# EAGLE schematic team18 (EAGLE 8.6.3)
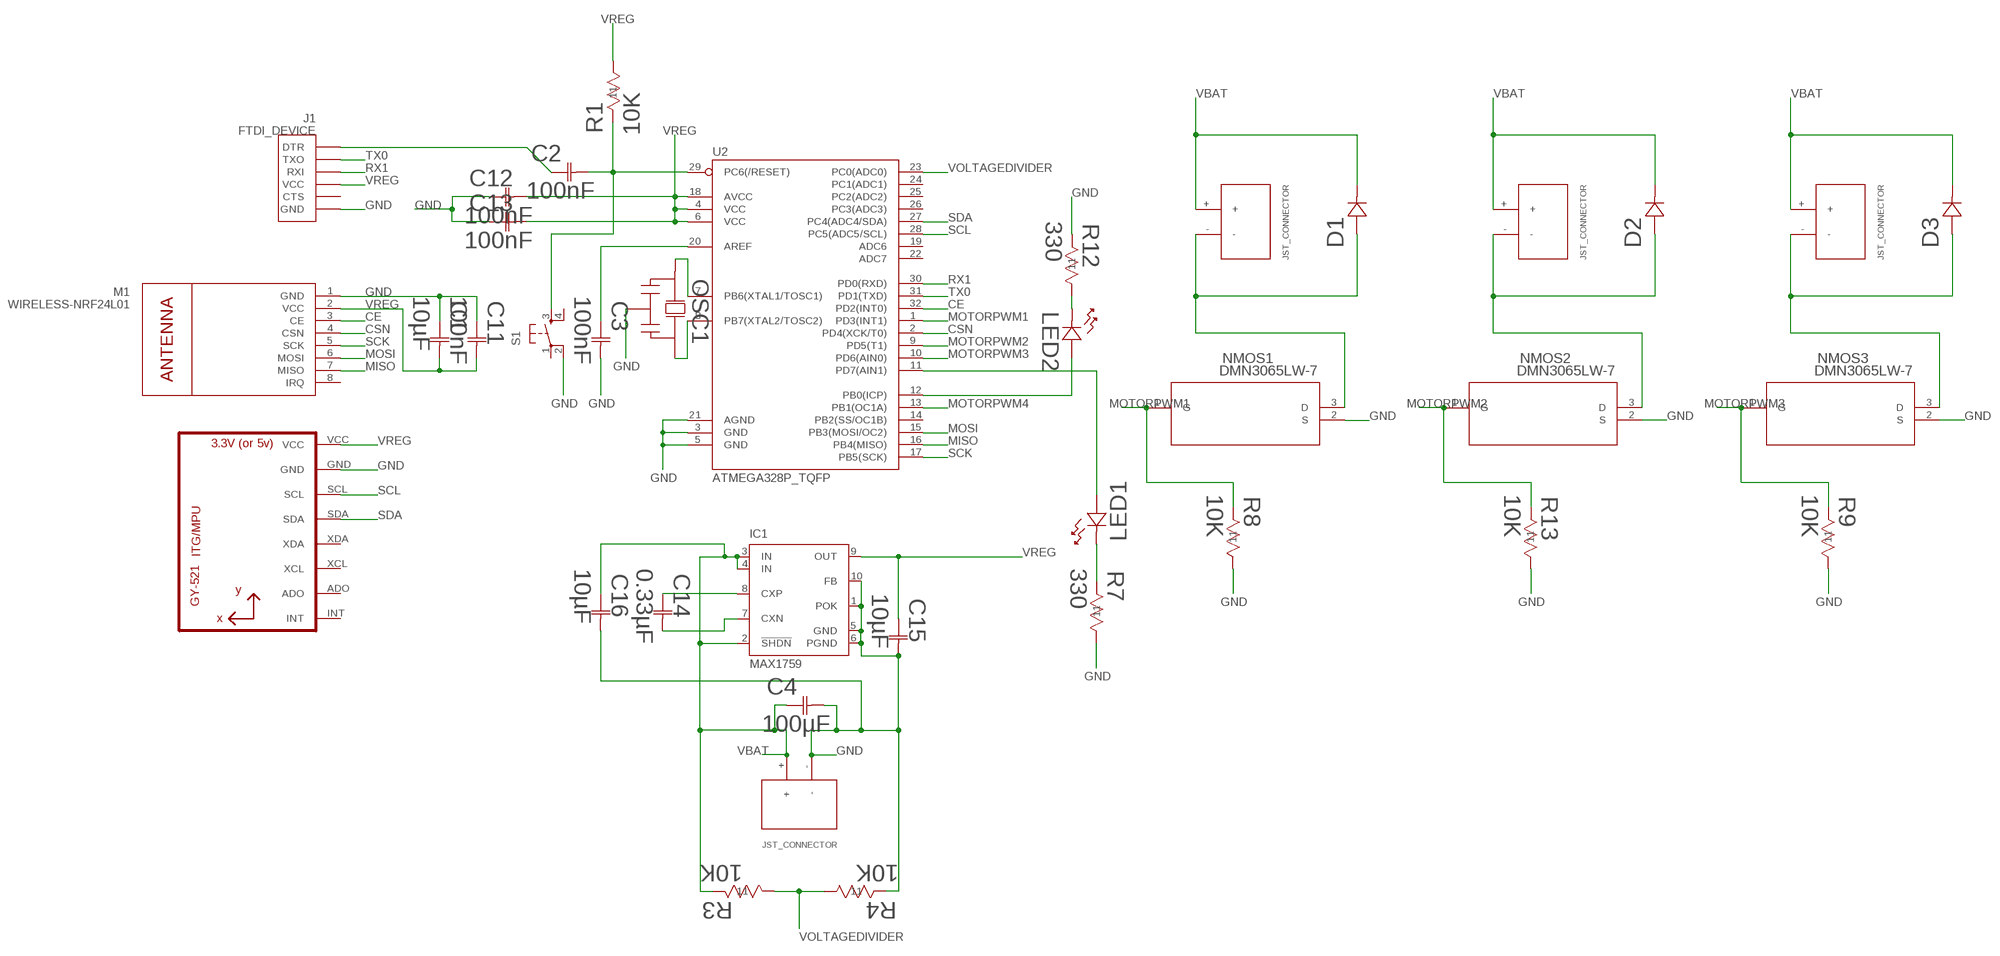
[diagram p0: schematic, sheet 1, part 1 of 2]
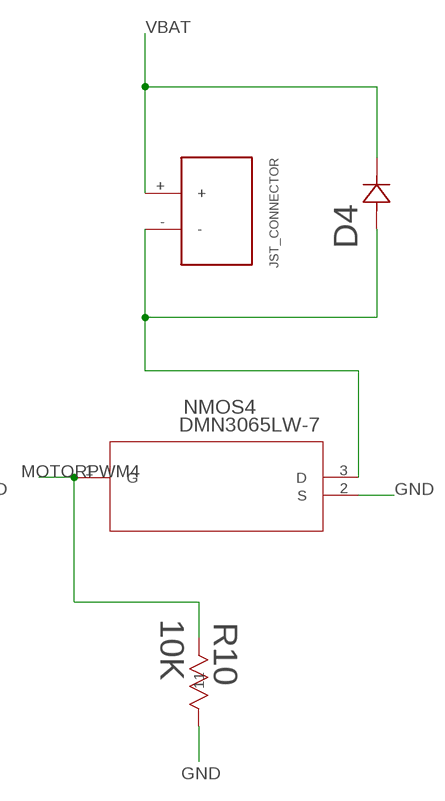
[diagram p1: schematic, sheet 1, part 2 of 2]

## Parts
BATTERY  JST_CONNECTOR_FEMALE  [JST_CONNECTOR_FEMALE]
C1  10µF  GRM188R60J106ME47D  [G-188]
C2  100nF  C1608X5R1H104K080AA  [CAP_1608]
C3  100nF  C1608X5R1H104K080AA  [CAP_1608]
C4  100µF  C3216X5R0J107M160AB  [CAP_3216]
C11  100nF  C1608X5R1H104K080AA  [CAP_1608]
C12  100nF  C1608X5R1H104K080AA  [CAP_1608]
C13  100nF  C1608X5R1H104K080AA  [CAP_1608]
C14  0.33µF  GRM188R71C334KA01D  [G-188]
C15  10µF  GRM188R60J106ME47D  [G-188]
C16  10µF  GRM188R60J106ME47D  [G-188]
D1  BAT60JFILM  [SOD-323]
D2  BAT60JFILM  [SOD-323]
D3  BAT60JFILM  [SOD-323]
D4  BAT60JFILM  [SOD-323]
IC1  MAX1759  [UMAX10]
J1  FTDI_DEVICE  [FTDI_DEVICE_SIDE]
LED1  5988070107F  [LED_DIALIGHT_598]
LED2  5988070107F  [LED_DIALIGHT_598]
M1  WIRELESS-NRF24L01  [WIRELESS-NRF24L01]
MOTOR1  JST_CONNECTOR_FEMALE  [JST_CONNECTOR_FEMALE]
MOTOR2  JST_CONNECTOR_FEMALE  [JST_CONNECTOR_FEMALE]
MOTOR3  JST_CONNECTOR_FEMALE  [JST_CONNECTOR_FEMALE]
MOTOR4  JST_CONNECTOR_FEMALE  [JST_CONNECTOR_FEMALE]
NMOS1  DMN3065LW-7  [SOT-323W/NEW]
NMOS2  DMN3065LW-7  [SOT-323W/NEW]
NMOS3  DMN3065LW-7  [SOT-323W/NEW]
NMOS4  DMN3065LW-7  [SOT-323W/NEW]
OSC1  CSTCE8M00G52-R0  [CSTCE]
R1  10K  MCT06030C1002FP500  [0603]
R3  10K  MCT06030C1002FP500  [0603]
R4  10K  MCT06030C1002FP500  [0603]
R7  330  CR0603-JW-331ELF  [BO_CR0603]
R8  10K  MCT06030C1002FP500  [0603]
R9  10K  MCT06030C1002FP500  [0603]
R10  10K  MCT06030C1002FP500  [0603]
R12  330  CR0603-JW-331ELF  [BO_CR0603]
R13  10K  MCT06030C1002FP500  [0603]
S1  TAC_SWITCHSMD  [TACTILE_SWITCH_SMD]
U1  GY-521MPU6050  [GY-521]
U2  ATMEGA328P_TQFP  [TQFP32-08]

## Nets
CE [digital]: M1.3(CE) U2.32(PD2(INT0))
CSN [digital]: M1.4(CSN) U2.2(PD4(XCK/T0))
GND [power]: BATTERY.- C1.1 C3.2 C4.2 C11.1 C12.1 C13.1 C15.2 C16.2 IC1.1(POK) IC1.5(GND) IC1.6(PGND) IC1.10(FB) J1.P$6(GND) M1.1(GND) NMOS1.2(S) NMOS2.2(S) NMOS3.2(S) NMOS4.2(S) OSC1.2 R4.1 R7.2 R8.2 R9.2 R10.2 R12.1 R13.2 S1.2 U1.GND U2.3(GND) U2.5(GND) U2.21(AGND)
MISO [digital]: M1.7(MISO) U2.16(PB4(MISO))
MOSI [digital]: M1.6(MOSI) U2.15(PB3(MOSI/OC2))
MOTORPWM1 [analog]: NMOS1.1(G) R8.1 U2.1(PD3(INT1))
MOTORPWM2 [analog]: NMOS2.1(G) R13.1 U2.9(PD5(T1))
MOTORPWM3 [analog]: NMOS3.1(G) R9.1 U2.10(PD6(AIN0))
MOTORPWM4 [analog]: NMOS4.1(G) R10.1 U2.13(PB1(OC1A))
N$1 [power]: D2.2 MOTOR2.- NMOS2.3(D)
N$2 [power]: C14.1 IC1.8(CXP)
N$3 [power]: D3.2 MOTOR3.- NMOS3.3(D)
N$4 [power]: D4.2 MOTOR4.- NMOS4.3(D)
N$5 [digital]: C2.2 R1.1 S1.3 U2.29(PC6(/RESET))
N$6 [power]: D1.2 MOTOR1.- NMOS1.3(D)
N$7 [digital]: C2.1 J1.P$1(DTR)
N$8 [power]: C14.2 IC1.7(CXN)
N$9 [digital]: LED1.2 U2.11(PD7(AIN1))
N$11 [digital]: LED2.2 U2.12(PB0(ICP))
N$12 [power]: C3.1 U2.20(AREF)
N$13 [digital]: LED1.1 R7.1
N$14 [digital]: OSC1.3 U2.7(PB6(XTAL1/TOSC1))
N$15 [digital]: OSC1.1 U2.8(PB7(XTAL2/TOSC2))
N$16 [digital]: LED2.1 R12.2
RX1 [digital]: J1.P$3(RXI) U2.30(PD0(RXD))
SCK [digital]: M1.5(SCK) U2.17(PB5(SCK))
SCL [digital]: U1.SCL U2.28(PC5(ADC5/SCL))
SDA [digital]: U1.SDA U2.27(PC4(ADC4/SDA))
TX0 [digital]: J1.P$2(TXO) U2.31(PD1(TXD))
VBAT [power]: BATTERY.+ C4.1 C16.1 D1.1 D2.1 D3.1 D4.1 IC1.2(!SHDN) IC1.3(IN) IC1.4(IN) MOTOR1.+ MOTOR2.+ MOTOR3.+ MOTOR4.+ R3.1
VOLTAGEDIVIDER [analog]: R3.2 R4.2 U2.23(PC0(ADC0))
VREG [power]: C1.2 C11.2 C12.2 C13.2 C15.1 IC1.9(OUT) J1.P$4(VCC) M1.2(VCC) R1.2 U1.VCC U2.4(VCC) U2.6(VCC) U2.18(AVCC)
Unconnected: J1.P$5(CTS) M1.8(IRQ) S1.1 S1.4 U1.ADO U1.INT U1.XCL U1.XDA U2.14(PB2(SS/OC1B)) U2.19(ADC6) U2.22(ADC7) U2.24(PC1(ADC1)) U2.25(PC2(ADC2)) U2.26(PC3(ADC3))

## Library data of the parts
BATTERY MOTOR1-MOTOR4 = quad:JST_CONNECTOR_FEMALE
C1 C15 C16 = Capacitor 10uF:GRM188R60J106ME47D; MANUFACTURER_PART_NUMBER: GRM188R60J106ME47D; VENDOR: Murata
C2 C3 C11-C13 = Capacitor 100nF:C1608X5R1H104K080AA; MANUFACTURER_PART_NUMBER: C1608X5R1H104K080AA; VENDOR: TDK
C4 = Capacitor 100uF:C3216X5R0J107M160AB; MANUFACTURER_PART_NUMBER: C3216X5R0J107M160AB; VENDOR: TDK
C14 = Capacitor 0.33uF:GRM188R71C334KA01D; MANUFACTURER_PART_NUMBER: GRM188R71C334KA01D; VENDOR: Murata
D1-D4 = Diode:BAT60JFILM; MANUFACTURER_PART_NUMBER: BAT60JFILM; VENDOR: STMicroelectronics
IC1 = maxim:MAX1759: Buck/Boost Regulating Charge Pump in µMAX Source: http://www.maxim-ic.com .. MAX1759.pdf; MF: MAXIM; MPN: MAX1759EUB+; OC_FARNELL: 1593325; OC_NEWARK: 61H9447
J1 = quad:FTDI_DEVICE: Connector which mates to FTDI basic or FTDI cable.
LED1 = LED Red:5988070107F; MANUFACTURER_PART_NUMBER: 5988070107F; VENDOR: Dialight
LED2 = LED Green:5988070107F; MANUFACTURER_PART_NUMBER: 5988070107F; VENDOR: Dialight
M1 = quad:WIRELESS-NRF24L01: 2.4 GHz Wireless Module based on NRF24L01 chip
NMOS1-NMOS4 = NMOS:DMN3065LW-7
OSC1 = Resonator:CSTCE8M00G52-R0; MANUFACTURER_PART_NUMBER: CSTCE8M00G52R0; VENDOR: Murata
R1 R3 R4 R8-R10 R13 = Resistor 10K:MCT06030C1002FP500; MANUFACTURER_PART_NUMBER: MCT06030C1002FP500; VENDOR: Vishay
R7 R12 = Resistor 330:CR0603-JW-331ELF; MANUFACTURER_PART_NUMBER: CR0603JW331ELF; VENDOR: Bourns Electronics
S1 = SparkFun:TAC_SWITCH: Momentary Switch Button commonly used for reset or general input. Spark Fun Electronics SKU : COM-00097
U1 = quad:GY-521
U2 = quad:ATMEGA328P_TQFP; PROD_ID: IC-09069

## Net classes
0 default: width 0.025 mm
1 digital: width 0.025 mm
2 analog: width 0.025 mm
3 power: width 0.025 mm